# Altium project isg_AL11b_equip_chip_board_passive.PrjPcb
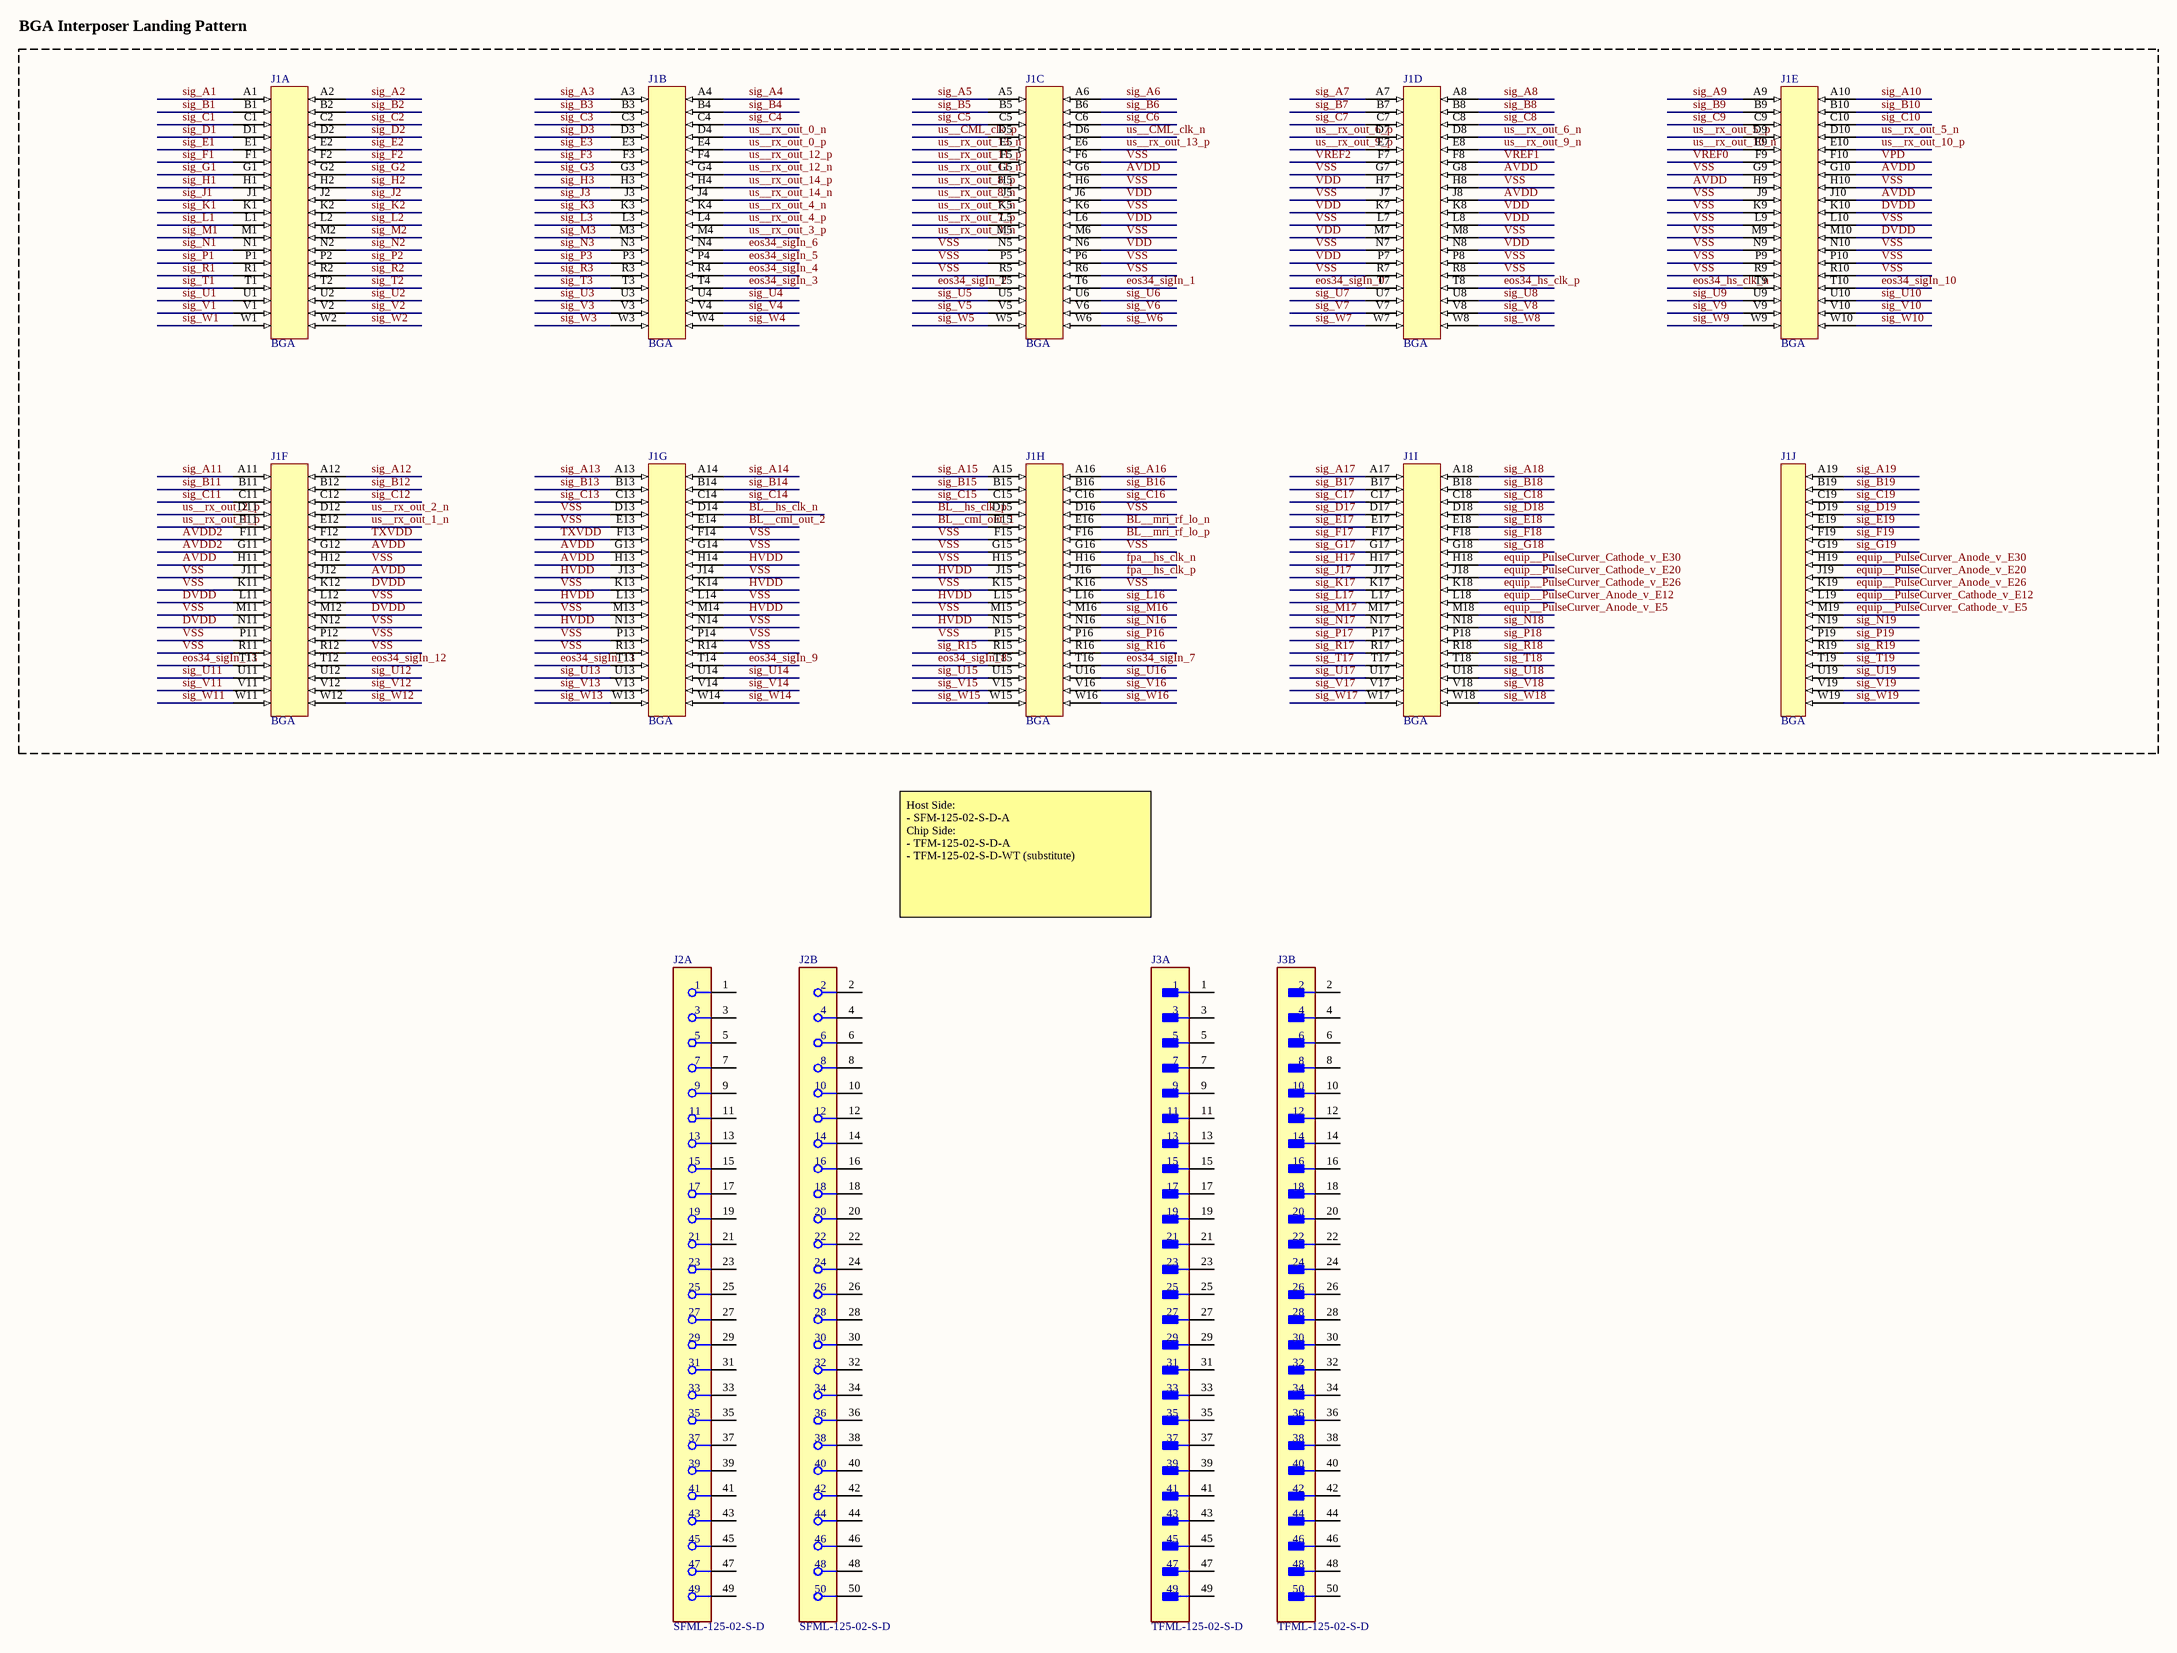
[diagram p0: isg_AL11b_equip_chip_board_passive.SchDoc]
1 sheet, 3 parts. Net scope: global (net labels, ports and power ports of the same name join across sheets).
Board file: isg_AL11b_equip_chip_board_passive.PcbDoc

## Sheet isg_AL11b_equip_chip_board_passive.SchDoc
size C; SheetNumber: 1; SheetTotal: 1

### Parts
J1  BGA  [BGA361x19_CHIP_BOARD_TOP]  (parts A,B,C,D,E,F,G,H,I,J of 10)
J2  SFML-125-02-S-D  [FP-SFML-125-02-S-D-MFG]  (parts A,B of 2)
J3  TFML-125-02-S-D  [FP-TFML-125-02-S-D-MFG]  (parts A,B of 2)

### Blocks framed on the sheet
BGA Interposer Landing Pattern: J1

### Nets
AVDD: J1.G6 J1.G8 J1.G10 J1.G12 J1.G13 J1.H9 J1.H11 J1.H13 J1.J8 J1.J10 J1.J12
AVDD2: J1.F11 J1.G11
BL__cml_out_1: J1.E15
BL__cml_out_2: J1.E14
BL__hs_clk_n: J1.D14
BL__hs_clk_p: J1.D15
BL__mri_rf_lo_n: J1.E16
BL__mri_rf_lo_p: J1.F16
DVDD: J1.K10 J1.K12 J1.L11 J1.M10 J1.M12 J1.N11
eos34_hs_clk_n: J1.T9
eos34_hs_clk_p: J1.T8
eos34_sigIn_0: J1.T7
eos34_sigIn_1: J1.T6
eos34_sigIn_2: J1.T5
eos34_sigIn_3: J1.T4
eos34_sigIn_4: J1.R4
eos34_sigIn_5: J1.P4
eos34_sigIn_6: J1.N4
eos34_sigIn_7: J1.T16
eos34_sigIn_8: J1.T15
eos34_sigIn_9: J1.T14
eos34_sigIn_10: J1.T10
eos34_sigIn_11: J1.T13
eos34_sigIn_12: J1.T12
eos34_sigIn_13: J1.T11
equip__PulseCurver_Anode_v_E5: J1.M18
equip__PulseCurver_Anode_v_E12: J1.L18
equip__PulseCurver_Anode_v_E20: J1.J19
equip__PulseCurver_Anode_v_E26: J1.K19
equip__PulseCurver_Anode_v_E30: J1.H19
equip__PulseCurver_Cathode_v_E5: J1.M19
equip__PulseCurver_Cathode_v_E12: J1.L19
equip__PulseCurver_Cathode_v_E20: J1.J18
equip__PulseCurver_Cathode_v_E26: J1.K18
equip__PulseCurver_Cathode_v_E30: J1.H18
fpa__hs_clk_n: J1.H16
fpa__hs_clk_p: J1.J16
HVDD: J1.H14 J1.J13 J1.J15 J1.K14 J1.L13 J1.L15 J1.M14 J1.N13 J1.N15
sig_A1: J1.A1
sig_A2: J1.A2
sig_A3: J1.A3
sig_A4: J1.A4
sig_A5: J1.A5
sig_A6: J1.A6
sig_A7: J1.A7
sig_A8: J1.A8
sig_A9: J1.A9
sig_A10: J1.A10
sig_A11: J1.A11
sig_A12: J1.A12
sig_A13: J1.A13
sig_A14: J1.A14
sig_A15: J1.A15
sig_A16: J1.A16
sig_A17: J1.A17
sig_A18: J1.A18
sig_A19: J1.A19
sig_B1: J1.B1
sig_B2: J1.B2
sig_B3: J1.B3
sig_B4: J1.B4
sig_B5: J1.B5
sig_B6: J1.B6
sig_B7: J1.B7
sig_B8: J1.B8
sig_B9: J1.B9
sig_B10: J1.B10
sig_B11: J1.B11
sig_B12: J1.B12
sig_B13: J1.B13
sig_B14: J1.B14
sig_B15: J1.B15
sig_B16: J1.B16
sig_B17: J1.B17
sig_B18: J1.B18
sig_B19: J1.B19
sig_C1: J1.C1
sig_C2: J1.C2
sig_C3: J1.C3
sig_C4: J1.C4
sig_C5: J1.C5
sig_C6: J1.C6
sig_C7: J1.C7
sig_C8: J1.C8
sig_C9: J1.C9
sig_C10: J1.C10
sig_C11: J1.C11
sig_C12: J1.C12
sig_C13: J1.C13
sig_C14: J1.C14
sig_C15: J1.C15
sig_C16: J1.C16
sig_C17: J1.C17
sig_C18: J1.C18
sig_C19: J1.C19
sig_D1: J1.D1
sig_D2: J1.D2
sig_D3: J1.D3
sig_D17: J1.D17
sig_D18: J1.D18
sig_D19: J1.D19
sig_E1: J1.E1
sig_E2: J1.E2
sig_E3: J1.E3
sig_E17: J1.E17
sig_E18: J1.E18
sig_E19: J1.E19
sig_F1: J1.F1
sig_F2: J1.F2
sig_F3: J1.F3
sig_F17: J1.F17
sig_F18: J1.F18
sig_F19: J1.F19
sig_G1: J1.G1
sig_G2: J1.G2
sig_G3: J1.G3
sig_G17: J1.G17
sig_G18: J1.G18
sig_G19: J1.G19
sig_H1: J1.H1
sig_H2: J1.H2
sig_H3: J1.H3
sig_H17: J1.H17
sig_J1: J1.J1
sig_J2: J1.J2
sig_J3: J1.J3
sig_J17: J1.J17
sig_K1: J1.K1
sig_K2: J1.K2
sig_K3: J1.K3
sig_K17: J1.K17
sig_L1: J1.L1
sig_L2: J1.L2
sig_L3: J1.L3
sig_L16: J1.L16
sig_L17: J1.L17
sig_M1: J1.M1
sig_M2: J1.M2
sig_M3: J1.M3
sig_M16: J1.M16
sig_M17: J1.M17
sig_N1: J1.N1
sig_N2: J1.N2
sig_N3: J1.N3
sig_N16: J1.N16
sig_N17: J1.N17
sig_N18: J1.N18
sig_N19: J1.N19
sig_P1: J1.P1
sig_P2: J1.P2
sig_P3: J1.P3
sig_P16: J1.P16
sig_P17: J1.P17
sig_P18: J1.P18
sig_P19: J1.P19
sig_R1: J1.R1
sig_R2: J1.R2
sig_R3: J1.R3
sig_R15: J1.R15
sig_R16: J1.R16
sig_R17: J1.R17
sig_R18: J1.R18
sig_R19: J1.R19
sig_T1: J1.T1
sig_T2: J1.T2
sig_T3: J1.T3
sig_T17: J1.T17
sig_T18: J1.T18
sig_T19: J1.T19
sig_U1: J1.U1
sig_U2: J1.U2
sig_U3: J1.U3
sig_U4: J1.U4
sig_U5: J1.U5
sig_U6: J1.U6
sig_U7: J1.U7
sig_U8: J1.U8
sig_U9: J1.U9
sig_U10: J1.U10
sig_U11: J1.U11
sig_U12: J1.U12
sig_U13: J1.U13
sig_U14: J1.U14
sig_U15: J1.U15
sig_U16: J1.U16
sig_U17: J1.U17
sig_U18: J1.U18
sig_U19: J1.U19
sig_V1: J1.V1
sig_V2: J1.V2
sig_V3: J1.V3
sig_V4: J1.V4
sig_V5: J1.V5
sig_V6: J1.V6
sig_V7: J1.V7
sig_V8: J1.V8
sig_V9: J1.V9
sig_V10: J1.V10
sig_V11: J1.V11
sig_V12: J1.V12
sig_V13: J1.V13
sig_V14: J1.V14
sig_V15: J1.V15
sig_V16: J1.V16
sig_V17: J1.V17
sig_V18: J1.V18
sig_V19: J1.V19
sig_W1: J1.W1
sig_W2: J1.W2
sig_W3: J1.W3
sig_W4: J1.W4
sig_W5: J1.W5
sig_W6: J1.W6
sig_W7: J1.W7
sig_W8: J1.W8
sig_W9: J1.W9
sig_W10: J1.W10
sig_W11: J1.W11
sig_W12: J1.W12
sig_W13: J1.W13
sig_W14: J1.W14
sig_W15: J1.W15
sig_W16: J1.W16
sig_W17: J1.W17
sig_W18: J1.W18
sig_W19: J1.W19
TXVDD: J1.F12 J1.F13
us__CML_clk_n: J1.D6
us__CML_clk_p: J1.D5
us__rx_out_0_n: J1.D4
us__rx_out_0_p: J1.E4
us__rx_out_1_n: J1.E12
us__rx_out_1_p: J1.E11
us__rx_out_2_n: J1.D12
us__rx_out_2_p: J1.D11
us__rx_out_3_n: J1.M5
us__rx_out_3_p: J1.M4
us__rx_out_4_n: J1.K4
us__rx_out_4_p: J1.L4
us__rx_out_5_n: J1.D10
us__rx_out_5_p: J1.D9
us__rx_out_6_n: J1.D8
us__rx_out_6_p: J1.D7
us__rx_out_7_n: J1.K5
us__rx_out_7_p: J1.L5
us__rx_out_8_n: J1.J5
us__rx_out_8_p: J1.H5
us__rx_out_9_n: J1.E8
us__rx_out_9_p: J1.E7
us__rx_out_10_n: J1.E9
us__rx_out_10_p: J1.E10
us__rx_out_11_n: J1.G5
us__rx_out_11_p: J1.F5
us__rx_out_12_n: J1.G4
us__rx_out_12_p: J1.F4
us__rx_out_13_n: J1.E5
us__rx_out_13_p: J1.E6
us__rx_out_14_n: J1.J4
us__rx_out_14_p: J1.H4
VDD: J1.H7 J1.J6 J1.K7 J1.K8 J1.L6 J1.L8 J1.M7 J1.N6 J1.N8 J1.P7
VPD: J1.F10
VREF0: J1.F9
VREF1: J1.F8
VREF2: J1.F7
VSS: J1.D13 J1.D16 J1.E13 J1.F6 J1.F14 J1.F15 J1.G7 J1.G9 J1.G14 J1.G15 J1.G16 J1.H6 J1.H8 J1.H10 J1.H12 J1.H15 J1.J7 J1.J9 J1.J11 J1.J14 J1.K6 J1.K9 J1.K11 J1.K13 J1.K15 J1.K16 J1.L7 J1.L9 J1.L10 J1.L12 J1.L14 J1.M6 J1.M8 J1.M9 J1.M11 J1.M13 J1.M15 J1.N5 J1.N7 J1.N9 J1.N10 J1.N12 J1.N14 J1.P5 J1.P6 J1.P8 J1.P9 J1.P10 J1.P11 J1.P12 J1.P13 J1.P14 J1.P15 J1.R5 J1.R6 J1.R7 J1.R8 J1.R9 J1.R10 J1.R11 J1.R12 J1.R13 J1.R14

Not connected (* = marked no-connect by the designer): J2 1 2 3 4 5 6 7 8 9 10 11 12 13 14 15 16 17 18 19 20 21 22 23 24 25 26 27 28 29 30 31 32 33 34 35 36 37 38 39 40 41 42 43 44 45 46 47 48 49 50; J3 1 2 3 4 5 6 7 8 9 10 11 12 13 14 15 16 17 18 19 20 21 22 23 24 25 26 27 28 29 30 31 32 33 34 35 36 37 38 39 40 41 42 43 44 45 46 47 48 49 50

### Notes on the sheet
- Host Side:
  - SFM-125-02-S-D-A
  Chip Side:
  - TFM-125-02-S-D-A
  - TFM-125-02-S-D-WT (substitute)

### Library data of the parts
J2 = CMP-02766-000144-1: CONN RCPT 50POS 0.05 GOLD SMD; Row Spacing: 0.05inch; Gender: Receptacle; Contact Resistance: 15mR; Max Voltage Rating (AC): 350V; Number of Positions: 50; Current Rating: 5A; Pitch: 1.27mm; Min Operating Temperature: -55°C; Color: Black; Contact Material: Copper; Connector Type: Receptacle; REACH SVHC: No SVHC; Number of Contacts: 50; Max Operating Temperature: 125°C; Fastening Type: Ramp; Housing Material: Polymer; Length: 35.69mm; Housing Color: Black; Number of Rows: 2; Termination: Solder; Mount: Surface Mount; Depth: 3.68mm; Orientation: Straight; Contact Plating: Gold; Packaging: Rail/Tube; Voltage Rating: 350V
J3 = CMP-02766-000137-1: CONN HEADER SMD 50POS 1.27MM; Voltage Rating: 350V; Number of Positions: 50; Max Current Rating: 5A; Connector Type: Male Pin; Row Spacing: 0.05inch; Gender: Male; Contact Material: Bronze; Packaging: Rail/Tube; Length: 34.93mm; Termination: Solder; Contact Mating Length: 0.134inch; Contact Plating: Gold; Pitch: 1.27mm; Mount: Surface Mount; Lead Free: Lead Free; Fastening Type: Friction; Number of Contacts: 50; Depth: 5.72mm; Housing Material: Polymer; Max Operating Temperature: 125°C; Max Voltage Rating (AC): 350V; Number of Rows: 2; Color: Black; Housing Color: Black; REACH SVHC: No SVHC; Min Operating Temperature: -55°C; Orientation: Straight; Current Rating: 5A